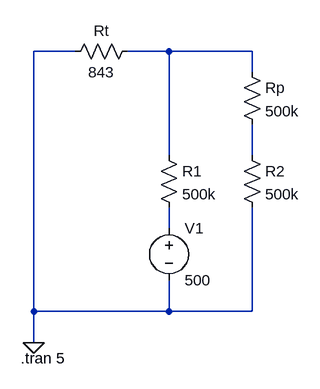
[diagram p0: schematic BasicLung.asc]
BasicLung.asc, the LTspice schematic file:
Version 4
SHEET 1 880 680
WIRE 0 48 -64 48
WIRE 144 48 80 48
WIRE 272 48 144 48
WIRE 272 80 272 48
WIRE 144 208 144 48
WIRE 272 208 272 160
WIRE 144 320 144 288
WIRE -64 448 -64 48
WIRE 144 448 144 400
WIRE 144 448 -64 448
WIRE 272 448 272 288
WIRE 272 448 144 448
WIRE -64 496 -64 448
FLAG -64 496 0
SYMBOL res 96 32 R90
WINDOW 0 0 56 VBottom 2
WINDOW 3 32 56 VTop 2
SYMATTR InstName Rt
SYMATTR Value 843
SYMBOL res 128 192 R0
SYMATTR InstName R1
SYMATTR Value 500k
SYMBOL res 256 192 R0
SYMATTR InstName R2
SYMATTR Value 500k
SYMBOL res 256 64 R0
SYMATTR InstName Rp
SYMATTR Value 500k
SYMBOL voltage 144 304 R0
WINDOW 123 0 0 Left 0
WINDOW 39 0 0 Left 0
SYMATTR InstName V1
SYMATTR Value 500
TEXT -84 520 Left 2 !.tran 5

The netlist it stands for:
* BasicLung.asc
Rt N001 0 843
R1 N001 N003 500k
R2 N002 0 500k
Rp N001 N002 500k
V1 N003 0 500
.tran 5
.backanno
.end